# EAGLE schematic dash-board1 (EAGLE 4.16)
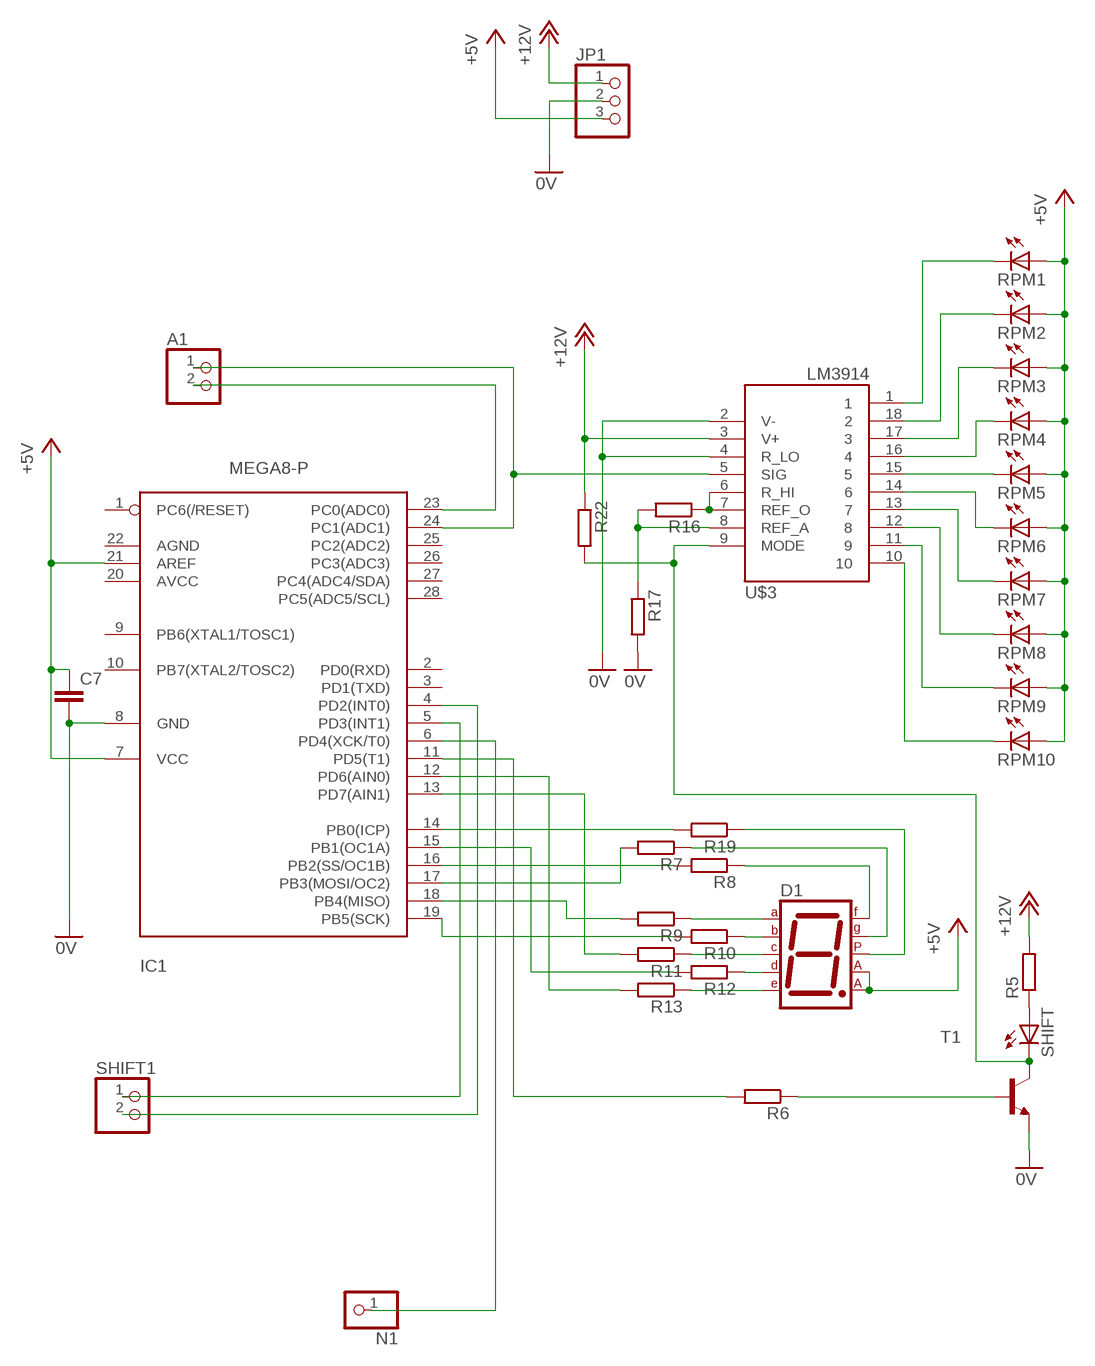
[diagram p0: schematic, sheet 1]

## Parts
A1  PINHD-1X2  [1X02]
C7  C-EU050-025X075  [C050-025X075]
D1  7SEG-CA  [7SEG-13]
IC1  MEGA8-P  [DIL28-3]
JP1  PINHD-1X3  [1X03]
N1  PINHD-1X1  [1X01]
R5  R-EU_0204/7  [0204/7]
R6  R-EU_0204/7  [0204/7]
R7  R-EU_0204/7  [0204/7]
R8  R-EU_0204/7  [0204/7]
R9  R-EU_0204/7  [0204/7]
R10  R-EU_0204/7  [0204/7]
R11  R-EU_0204/7  [0204/7]
R12  R-EU_0204/7  [0204/7]
R13  R-EU_0204/7  [0204/7]
R16  R-EU_0204/7  [0204/7]
R17  R-EU_0204/7  [0204/7]
R19  R-EU_0204/7  [0204/7]
R22  R-EU_0204/7  [0204/7]
RPM1  LED3MM  [LED3MM]
RPM2  LED3MM  [LED3MM]
RPM3  LED3MM  [LED3MM]
RPM4  LED3MM  [LED3MM]
RPM5  LED3MM  [LED3MM]
RPM6  LED3MM  [LED3MM]
RPM7  LED3MM  [LED3MM]
RPM8  LED3MM  [LED3MM]
RPM9  LED3MM  [LED3MM]
RPM10  LED3MM  [LED3MM]
SHIFT  LED5MM  [LED5MM]
SHIFT1  PINHD-1X2  [1X02]
T1  BC547B-NPN-TO92-EBC  [TO92-EBC]
U$3  LM3914  [DIL18]

## Nets
0V: C7.2 IC1.8(GND) JP1.2 R17.2 T1.E U$3.2(V-) U$3.4(R_LO)
+5V: C7.1 D1.3(CA1) D1.8(CA2) IC1.7(VCC) IC1.21(AREF) JP1.3 RPM1.A RPM2.A RPM3.A RPM4.A RPM5.A RPM6.A RPM7.A RPM8.A RPM9.A RPM10.A
+12V: JP1.1 R5.2 R22.1 U$3.3(V+)
N$4: RPM1.K(C) U$3.1
N$5: RPM2.K(C) U$3.18
N$6: RPM3.K(C) U$3.17
N$7: RPM4.K(C) U$3.16
N$8: RPM5.K(C) U$3.15
N$9: RPM6.K(C) U$3.14
N$10: RPM7.K(C) U$3.13
N$11: RPM8.K(C) U$3.12
N$12: RPM9.K(C) U$3.11
N$13: RPM10.K(C) U$3.10
N$18: D1.10(G) R7.1
N$20: R22.2 SHIFT.K(C) T1.C U$3.9(MODE)
N$21: R5.1 SHIFT.A
N$22: R6.1 T1.B
N$24: D1.9(F) R8.1
N$25: D1.7(A) R9.1
N$26: D1.6(B) R10.1
N$27: D1.4(C) R11.1
N$28: D1.2(D) R12.1
N$29: D1.1(E) R13.1
N$30: IC1.19(PB5(SCK)) R10.2
N$31: IC1.18(PB4(MISO)) R9.2
N$32: IC1.17(PB3(MOSI/OC2)) R7.2
N$33: IC1.16(PB2(SS/OC1B)) R8.2
N$34: IC1.15(PB1(OC1A)) R12.2
N$35: IC1.12(PD6(AIN0)) R13.2
N$36: IC1.13(PD7(AIN1)) R11.2
N$37: A1.1 IC1.24(PC1(ADC1)) U$3.5(SIG)
N$38: A1.2 IC1.23(PC0(ADC0))
N$40: IC1.4(PD2(INT0)) SHIFT1.2
N$41: IC1.11(PD5(T1)) R6.2
N$43: R16.1 U$3.6(R_HI) U$3.7(REF_O)
N$44: R16.2 R17.1 U$3.8(REF_A)
N$45: D1.5(DP) R19.1
N$46: IC1.14(PB0(ICP)) R19.2
N$47: IC1.6(PD4(XCK/T0)) N1.1
N$65: IC1.5(PD3(INT1)) SHIFT1.1
Unconnected: IC1.1(PC6(/RESET)) IC1.2(PD0(RXD)) IC1.3(PD1(TXD)) IC1.9(PB6(XTAL1/TOSC1)) IC1.10(PB7(XTAL2/TOSC2)) IC1.20(AVCC) IC1.22(AGND) IC1.25(PC2(ADC2)) IC1.26(PC3(ADC3)) IC1.27(PC4(ADC4/SDA)) IC1.28(PC5(ADC5/SCL))

## Library data of the parts
A1 SHIFT1 = pinhead:PINHD-1X2: PIN HEADER
C7 = rcl:C-EU: CAPACITOR, European symbol
D1 = special:7SEG-CA: 7-segment DISPLAY single anode, 13 mm
IC1 = atmel:MEGA8-P: MICROCONTROLLER 8 Kbytes FLASH 1 kbytes SRAM 512 bytes EEPROM USART 4-channel 10 bit ADC 2-channel 8 bit ADC Source: avr.lbr
JP1 = pinhead:PINHD-1X3: PIN HEADER
N1 = pinhead:PINHD-1X1: PIN HEADER
R5-R13 R16 R17 R19 R22 = rcl:R-EU_: RESISTOR, European symbol
RPM1-RPM10 SHIFT = led:LED: LED OSRAM: - CHIPLED LG R971, LG N971, LY N971, LG Q971, LY Q971, LO R971, LY R971 LH N974, LH R974 LS Q976, LO Q976, LY Q976 LO Q996 - Hyper CHIPLED LW Q18S LB Q993, LB Q99A, LB R99A - SideLED LS A670, LO A670, LY A670, LG A670, LP A670 LB A673, LV A673, LT A673, LW A673 LH A674 LY A675 LS A676, LA A676, LO A676, LY A676, LW A676 LS A679, LY A679, LG A679 - Hyper Micro SIDELED® LS Y876, LA Y876, LO Y876, LY Y876 LT Y87S - SmartLED LW L88C, LW L88S LB L89C, LB L89S, LG L890 LS L89K, LO L89K, LY L89K LS L896, LA L896, LO L896, LY L896 - TOPLED LS T670, LO T670, LY T670, LG T670, LP T670 LSG T670, LSP T670, LSY T670, LOP T670, LYG T670 LG T671, LOG T671, LSG T671 LB T673, LV T673, LT T673, LW T673 LH T674 LS T676, LA T676, LO T676, LY T676, LB T676, LH T676, LSB T676, LW T676 LB T67C, LV T67C, LT T67C, LS T67K, LO T67K, LY T67K, LW E67C LS E67B, LA E67B, LO E67B, LY E67B, LB E67C, LV E67C, LT E67C LW T67C LS T679, LY T679, LG T679 LS T770, LO T770, LY T770, LG T770, LP T770 LB T773, LV T773, LT T773, LW T773 LH T774 LS E675, LA E675, LY E675, LS T675 LS T776, LA T776, LO T776, LY T776, LB T776 LHGB T686 LT T68C, LB T68C - Hyper Mini TOPLED® LB M676 - Mini TOPLED Santana® LG M470 LS M47K, LO M47K, LY M47K Source: http://www.osram.convergy.de/
T1 = transistor:*-NPN-: NPN Transistror
U$3 = rnie04:LM3914